# Altium schematic sheet HIVE_SIGHT_DECAWAVE1.SchDoc
size Tabloid; SheetNumber: 4; SheetTotal: 6; Sheet_Name: DECAWAVE; Size: 11x17
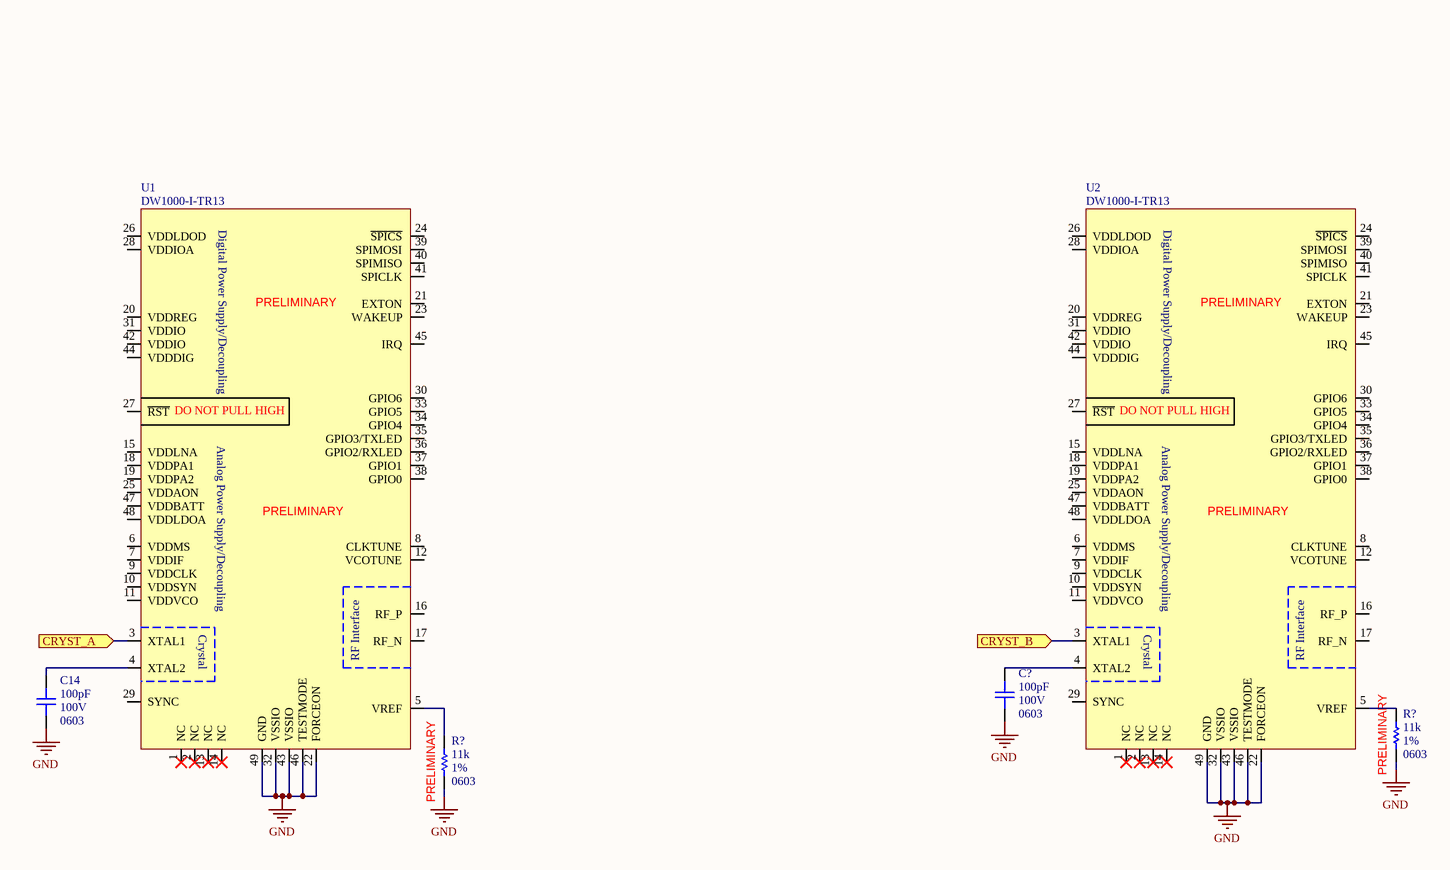
[diagram p0: HIVE_SIGHT_DECAWAVE1.SchDoc]

## Parts
(Parts that share a designator on the sheet are numbered #1, #2 ... from top to bottom, then left to right.)
C14  value 100pF  Package: 0603  Voltage Rating: 100V  [CAP_CER_0603]  (hidden comment: C0603C101J1HACAUTO)
C?  value 100pF  Package: 0603  Voltage Rating: 100V  [CAP_CER_0603]  (hidden comment: C0603C101J1HACAUTO)
R?#1  value 11k  Tolerance: 1%  Package: 0603  [RES_0603]  (hidden comment: RC0603FR-0711KL)
R?#2  value 11k  Tolerance: 1%  Package: 0603  [RES_0603]  (hidden comment: RC0603FR-0711KL)
U1  DW1000-I-TR13  [COM_XRC_DW1000-I-TR13]
U2  DW1000-I-TR13  [COM_XRC_DW1000-I-TR13]

## Ports
CRYST_A (in), CRYST_B (in)

## Nets
GND: C14.1 C?.1 R?#1.1 R?#2.1 U1.22(FORCEON) U1.32(VSSIO) U1.43(VSSIO) U1.46(TESTMODE) U1.49(GND) U2.22(FORCEON) U2.32(VSSIO) U2.43(VSSIO) U2.46(TESTMODE) U2.49(GND)
CRYST_A: U1.3(XTAL1) ; port CRYST_A
CRYST_B: U2.3(XTAL1) ; port CRYST_B
NetC14_2: C14.2 U1.4(XTAL2)
NetC?_2: C?.2 U2.4(XTAL2)
NetR?#1_2: R?#1.2 U2.5(VREF)
NetR?#2_2: R?#2.2 U1.5(VREF)

Not connected (* = marked no-connect by the designer): U1 1(NC)* 2(NC)* 6(VDDMS) 7(VDDIF) 8(CLKTUNE) 9(VDDCLK) 10(VDDSYN) 11(VDDVCO) 12(VCOTUNE) 13(NC)* 14(NC)* 15(VDDLNA) 16(RF_P) 17(RF_N) 18(VDDPA1) 19(VDDPA2) 20(VDDREG) 21(EXTON) 23(WAKEUP) 24(~{SPICS}) 25(VDDAON) 26(VDDLDOD) 27(~{RST}) 28(VDDIOA) 29(SYNC) 30(GPIO6) 31(VDDIO) 33(GPIO5) 34(GPIO4) 35(GPIO3/TXLED) 36(GPIO2/RXLED) 37(GPIO1) 38(GPIO0) 39(SPIMOSI) 40(SPIMISO) 41(SPICLK) 42(VDDIO) 44(VDDDIG) 45(IRQ) 47(VDDBATT) 48(VDDLDOA); U2 1(NC)* 2(NC)* 6(VDDMS) 7(VDDIF) 8(CLKTUNE) 9(VDDCLK) 10(VDDSYN) 11(VDDVCO) 12(VCOTUNE) 13(NC)* 14(NC)* 15(VDDLNA) 16(RF_P) 17(RF_N) 18(VDDPA1) 19(VDDPA2) 20(VDDREG) 21(EXTON) 23(WAKEUP) 24(~{SPICS}) 25(VDDAON) 26(VDDLDOD) 27(~{RST}) 28(VDDIOA) 29(SYNC) 30(GPIO6) 31(VDDIO) 33(GPIO5) 34(GPIO4) 35(GPIO3/TXLED) 36(GPIO2/RXLED) 37(GPIO1) 38(GPIO0) 39(SPIMOSI) 40(SPIMISO) 41(SPICLK) 42(VDDIO) 44(VDDDIG) 45(IRQ) 47(VDDBATT) 48(VDDLDOA)

## Notes on the sheet
- Sheet Name
- Project Title
- Global Project
- Size
- Group
- Revision
- Date
- Sheet
- of
- Filename
- Designers
- (in symbol COM_XCV_DW1000-I-TR13) Digital Power Supply/Decoupling; PRELIMINARY; DO NOT PULL HIGH; Analog Power Supply/Decoupling; Crystal; RF Interface
- (in symbol RES_RC0603FR-0711KL) PRELIMINARY

## Library data of the parts
C14 C? = CAP_CER_C0603C101J1HACAUTO: CAP - CER 100pF 5% 100V X8R Ultra stable - 0603; Manufacturer #1: KEMET; GRAMS Lib Spec: 2.9; Magnetic Material: Unknown; Polarized: No; Assembly Type: SMD; CreatedBy/Date: Patrick Dufour 2020-06-11; Current Rating: *; HelpURL: https://content.kemet.com/datasheets/KEM_C1007_X8R_ULTRA_150C_SMD.pdf; Manufacturer #2: *; Note: *; Part Number #1: C0603C101J1HACAUTO; Part Number #2: *; Power Max: *; Temperature: -55°C ~ 150°C; Tolerance: 5%; VerifiedBy: C.Paulin - 2020-06-24; Supplier 1: Digi-Key; Supplier Part Number 1: 399-16581-2-ND; Cryo: Unknown
R?#1 R?#2 = RES_RC0603FR-0711KL: RES - 11k 1% 1/10W - 0603; Manufacturer #1: Yageo; GRAMS Lib Spec: 2.8; Magnetic Material: Unknown; Polarized: No; Voltage Rating: 75V; Assembly Type: SMD; CreatedBy/Date: Philippe Arsenault/2020-07-14; Current Rating: *; HelpURL: https://www.yageo.com/upload/media/product/productsearch/datasheet/rchip/PYu-RC_Group_51_RoHS_L_10.pdf; Manufacturer #2: *; Note: *; Part Number #1: RC0603FR-0711KL; Part Number #2: *; Power Max: 1/10W; Temperature: -55°C ~ 155°C; Supplier 1: Digi-Key; Supplier Part Number 1: 311-11.0KHRCT-ND
U1 U2 = COM_XCV_DW1000-I-TR13: COM - UWB DECAWAVE (qorvo); Voltage Rating: 2.8 - 3.6 V; Current Rating: Rx 64mA/Tx 31mA; GRAMS Lib Spec: 2.8; Magnetic Material: Unknown; Polarized: Yes; Cryo: No; Value: *; Tolerance: *; Power Max: *; HelpURL: https://www.decawave.com/sites/default/files/resources/DW1000-Datasheet-V2.12.pdf; CreatedBy/Date: Philippe Arsenault/13-07-2020; Temperature: -40°C ~ 85°C; Package: QFN 48; Manufacturer #1: Decawave; Manufacturer #2: Qorvo; Note: *; Assembly Type: SMT; Part Number #2: *; Part Number #1: DW1000-I-TR13; Supplier 1: Digi-Key; Supplier Part Number 1: 1479-1001-1-ND